# Altium project TMC2208_TEST.PrjPcb
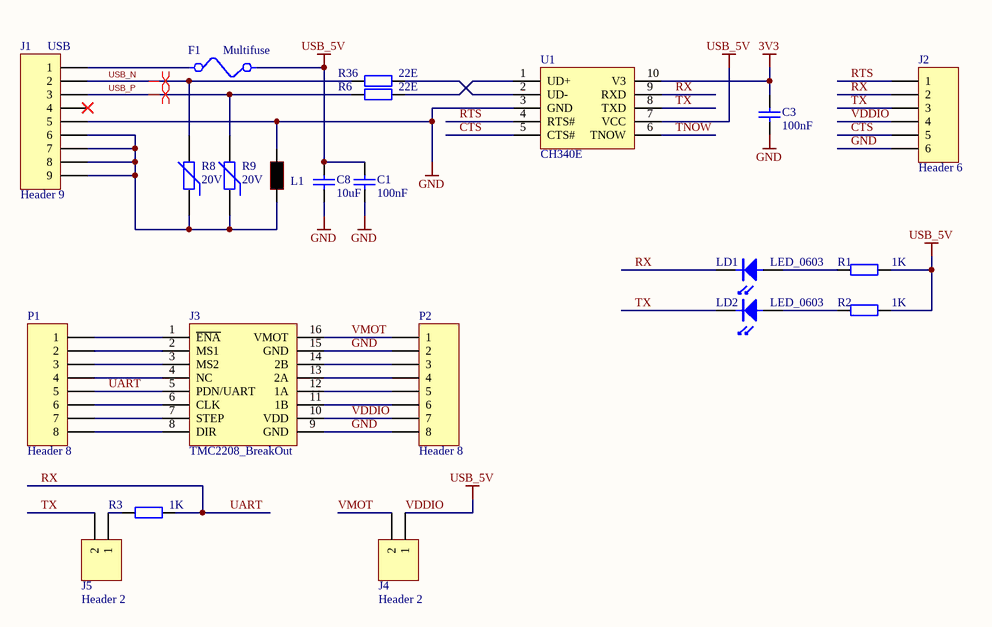
[diagram p0: TMC2208_TEST.SchDoc]
1 sheet, 22 parts. Net scope: global (net labels, ports and power ports of the same name join across sheets).
Board file: TMC_2208_TEST.PcbDoc

## Sheet TMC2208_TEST.SchDoc
size A4

### Parts
C1  100nF  [CAP0603]
C3  100nF  [CAP0603]
C8  10uF  [CAP0603]
F1  Multifuse  [Multifuse1812]
J1  Header 9  [MicroUSB]
J2  Header 6  [HDR1X6]
J3  TMC2208_BreakOut  [TMC2208]
J4  Header 2  [HDR1X2]
J5  Header 2  [HDR1X2]
L1  Bead  [L0805]  (value not drawn)
LD1  LED_0603  [LED0603]
LD2  LED_0603  [LED0603]
P1  Header 8  [Header 1X8]
P2  Header 8  [Header 1X8]
R1  1K  [RES0603]
R2  1K  [RES0603]
R3  1K  [RES0603]
R6  22E  [RES0603]
R8  20V  [RES0603]
R9  20V  [RES0603]
R36  22E  [RES0603]
U1  CH340E  [MSOP10]

### Nets
3V3: C3.2 U1.10(V3)
GND: C1.2 C3.1 C8.1 J1.5 J2.6 J3.9(GND) J3.15(GND) L1.1 P2.2 P2.8 U1.3(GND)
VDDIO: C1.1 C8.2 F1.2 J2.4 J3.10(VDD) J4.1 P2.7 R1.1 R2.1 U1.7(VCC)  [also labelled USB_5V]
CTS: J2.5 U1.5(CTS#)
RTS: J2.1 U1.4(RTS#)
RX: J2.2 J3.5(PDN/UART) LD1.1(A) P1.5 R3.2 U1.9(RXD)  [also labelled UART]
TNOW: U1.6(TNOW)
TX: J2.3 J5.2 LD2.1(A) U1.8(TXD)
USB_N: J1.2 R8.2 R36.1
USB_P: J1.3 R6.1 R9.2
VMOT: J3.16(VMOT) J4.2 P2.1
NetF1_1: F1.1 J1.1
NetJ1_6: J1.6 J1.7 J1.8 J1.9 L1.2 R8.1 R9.1
NetJ3_1: J3.1(~{ENA}) P1.1
NetJ3_2: J3.2(MS1) P1.2
NetJ3_3: J3.3(MS2) P1.3
NetJ3_4: J3.4(NC) P1.4
NetJ3_6: J3.6(CLK) P1.6
NetJ3_7: J3.7(STEP) P1.7
NetJ3_8: J3.8(DIR) P1.8
NetJ3_11: J3.11(1B) P2.6
NetJ3_12: J3.12(1A) P2.5
NetJ3_13: J3.13(2A) P2.4
NetJ3_14: J3.14(2B) P2.3
NetJ5_1: J5.1 R3.1
NetLD1_2: LD1.2(K) R1.2
NetLD2_2: LD2.2(K) R2.2
NetR6_2: R6.2 U1.1(UD+)
NetR36_2: R36.2 U1.2(UD-)

Not connected (* = marked no-connect by the designer): J1 4*

### Layout directives
differential pair: USB_N, USB_P

### Notes on the sheet
- (near J1) USB

### Library data of the parts
C1 C8 = Library_CAP-0002: RO X7R 100nF 10% 50V 0603; Faber ItemCode: 45068500; ID: Library_CAP-0002
  C1: Value: 100nF
  C8: Value: 10uF
C3 = Library_CAP-0006: RO X5R 1uF 10% 10V 0603; Faber ItemCode: 36310600; ID: Library_CAP-0006; Value: 100nF
F1 = Library_FUSE-0001: RO ZEK MULTI 500MA SMD 1812 MF-MSMF050-2 BOURNS; Faber ItemCode: 35502800; Info: MULTIFUSE, SMD, 0.5A; Value: 0.5A; ID: Library_FUSE-0001; Mfg: BOURNS; Mfg code: MF-MSMF050-2
J1 = Header 9: Header, 9-Pin; LatestRevisionDate: 17-Jul-2002; LatestRevisionNote: Re-released for DXP Platform.; Publisher: Altium Limited
J2 = Header 6: Header, 6-Pin; LatestRevisionDate: 17-Jul-2002; LatestRevisionNote: Re-released for DXP Platform.; Publisher: Altium Limited
J4 J5 = Header 2: Header, 2-Pin; LatestRevisionDate: 17-Jul-2002; LatestRevisionNote: Re-released for DXP Platform.; Publisher: Altium Limited
L1 = Library_COIL-0001: RO FERRIET BLM21PG221SN1D  0805; Faber ItemCode: 36571200; ID: Library_COIL-0001; Value: Bead
P1 P2 = Header 8: Header, 8-Pin; LatestRevisionDate: 17-Jul-2002; LatestRevisionNote: Re-released for DXP Platform.; Publisher: Altium Limited
R1-R3 R6 R36 = Library_RES-0007: RO RES 22E0 1% 0,063W 0603; Faber ItemCode: 36108300; ID: Library_RES-0007; Info: Resistor
  R1-R3: Value: 1K
  R6 R36: Value: 22E
R8 R9 = Library_RES-0012: RO VDR 0603 CG0603MLC-05E; Mfg: BOURNS; Faber ItemCode: 36925900; ID: Library_RES-0012; Mfg code: CG0603MLC-05E; Info: Varistor; Value: 20V